# EAGLE design led quadcoopter (EAGLE 7.5.0)
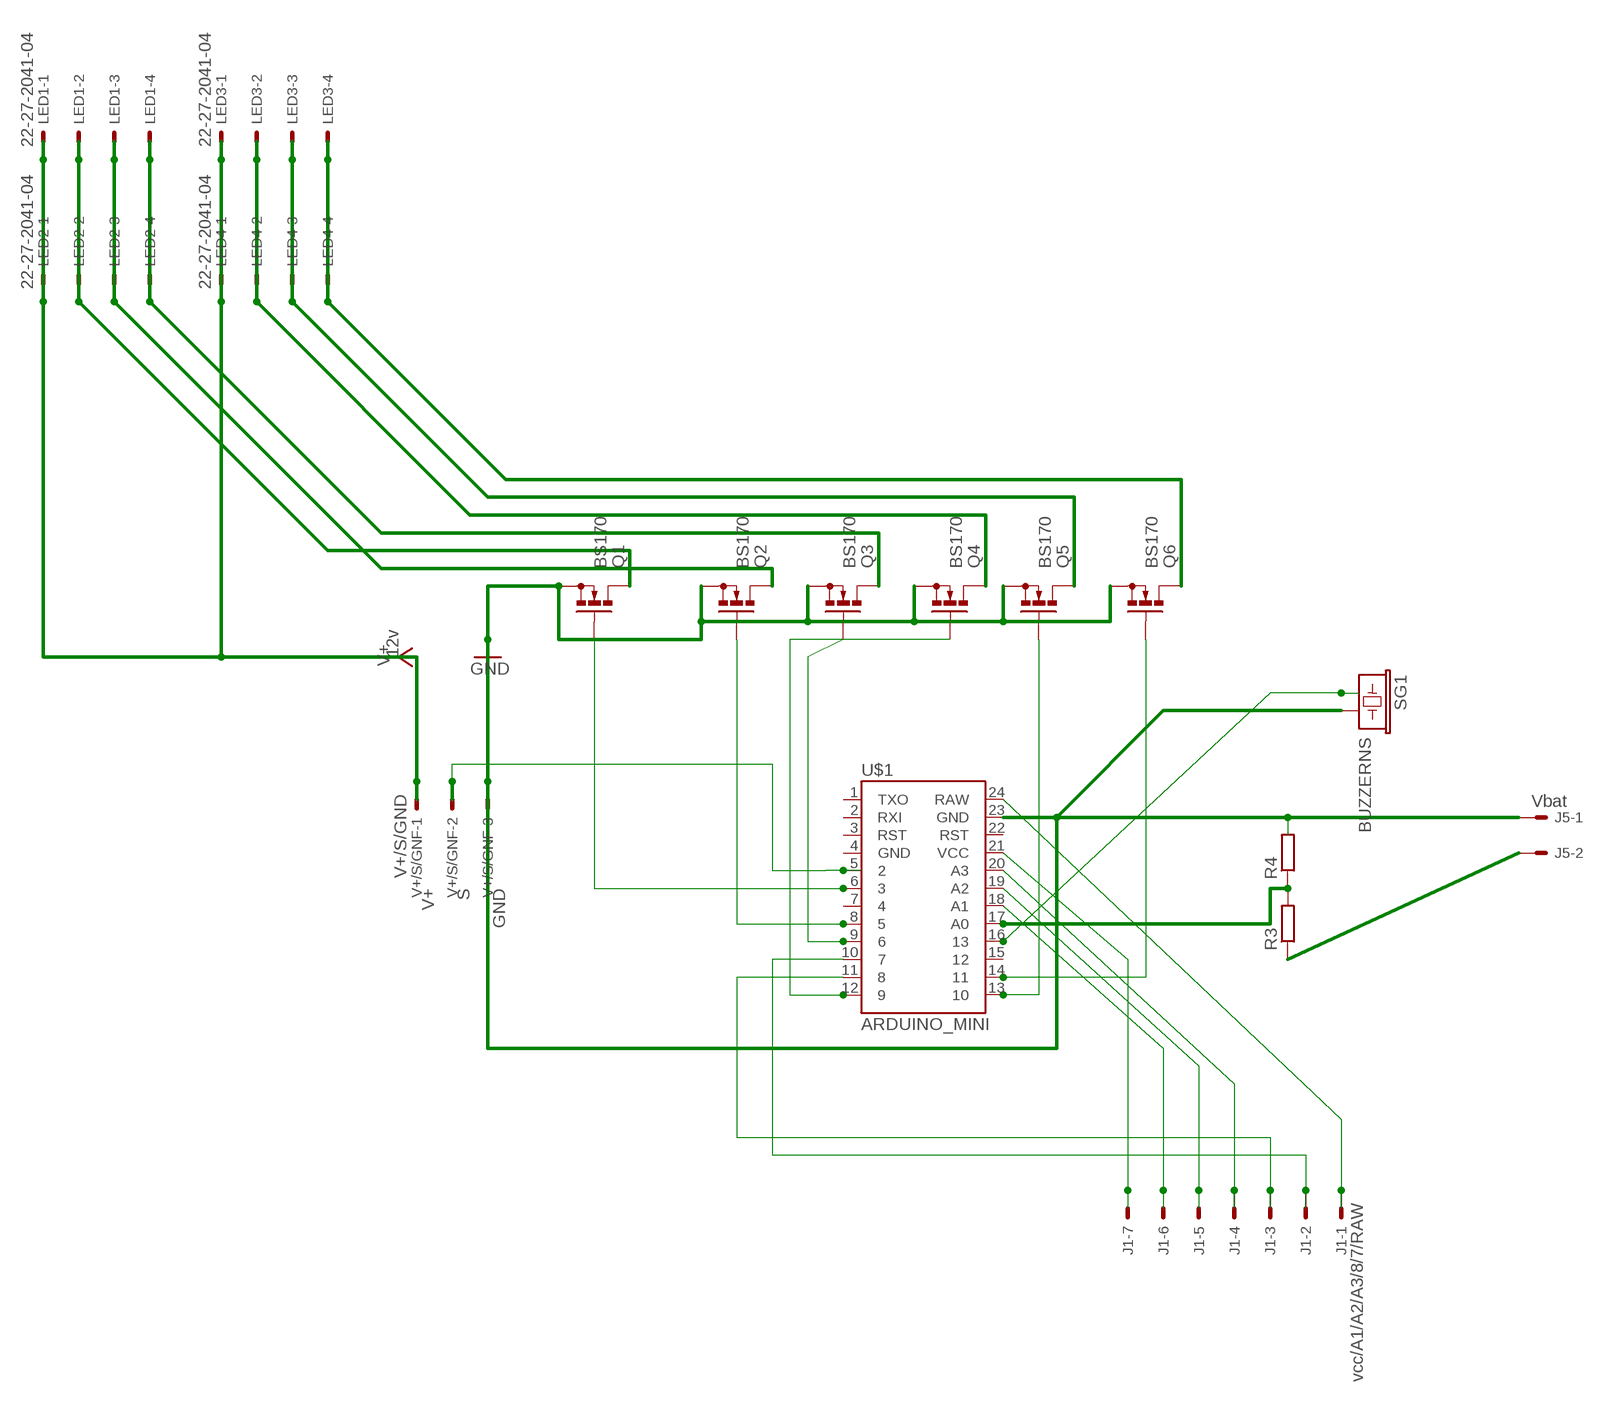
[diagram p0: schematic, sheet 1]

## Parts
J1  vcc/A1/A2/A3/8/7/RAW  22-27-2071-07  [6410-07]
J5  Vbat  22-27-2021-02  [6410-02]
LED1  22-27-2041-04  [6410-04]
LED2  22-27-2041-04  [6410-04]
LED3  22-27-2041-04  [6410-04]
LED4  22-27-2041-04  [6410-04]
Q1  BS170  [SOT54E]
Q2  BS170  [SOT54E]
Q3  BS170  [SOT54E]
Q4  BS170  [SOT54E]
Q5  BS170  [SOT54E]
Q6  BS170  [SOT54E]
R3  R-EU_0207/10  [0207/10]
R4  R-EU_0207/10  [0207/10]
SG1  BUZZERNS  [BUZZER-12MM-NS]
U$1  ARDUINO_MINI  [ARDUINO_MINI]
V+/S/GNF  V+/S/GND  22-27-2031-03  [6410-03]

## Nets
GND: J5.1 Q1.S Q2.S Q3.S Q4.S Q5.S Q6.S R4.2 SG1.- U$1.23(GND) V+/S/GNF.3
N$1: LED1.4 LED2.4 Q3.D
N$2: R3.2 R4.1 U$1.17(A0)
N$3: SG1.+ U$1.16
N$4: J1.1 U$1.24(RAW)
N$5: J1.7 U$1.21(VCC)
N$6: J1.6 U$1.18(A1)
N$7: J1.5 U$1.19(A2)
N$8: LED1.2 LED2.2 Q1.D
N$9: LED1.3 LED2.3 Q2.D
N$10: LED3.2 LED4.2 Q4.D
N$11: LED3.3 LED4.3 Q5.D
N$12: LED3.4 LED4.4 Q6.D
N$13: U$1.5 V+/S/GNF.2
N$14: J1.4 U$1.20(A3)
N$15: J1.3 U$1.11
N$16: Q1.G U$1.6
N$17: Q2.G U$1.8
N$18: Q3.G U$1.9
N$19: Q4.G U$1.12
N$20: Q5.G U$1.13
N$21: Q6.G U$1.14
N$22: J1.2 U$1.10
V+: LED1.1 LED2.1 LED3.1 LED4.1 V+/S/GNF.1
VBAT: J5.2 R3.1
Unconnected: U$1.1(TXO) U$1.2(RXI) U$1.3(RST) U$1.4(GND) U$1.7 U$1.15 U$1.22(RST)

## Library data of the parts
J1 = con-molex:22-?-07: CONNECTOR wire to board 2.54 mm (.1 inch) pitch header; OC_FARNELL: unknown; OC_NEWARK: unknown
J5 = con-molex:22-?-02: CONNECTOR wire to board 2.54 mm (.1 inch) pitch header; OC_FARNELL: unknown; OC_NEWARK: unknown
LED1-LED4 = con-molex:22-?-04: CONNECTOR wire to board 2.54 mm (.1 inch) pitch header; OC_FARNELL: unknown; OC_NEWARK: unknown
Q1-Q6 = transistor-small-signal:BS170: N-CHANNEL MOS FET
R3 R4 = rcl:R-EU_: RESISTOR, European symbol
SG1 = SparkFun-Electromechanical:BUZZER: Buzzer 12mm Spark Fun Electronics SKU : Comp-Buzzer
U$1 = SparkFun-Boards:ARDUINO_MINI: Arduino Pro Mini footprint
V+/S/GNF = con-molex:22-?-03: CONNECTOR wire to board 2.54 mm (.1 inch) pitch header; MF: V+; OC_FARNELL: GND; OC_NEWARK: S

## Board
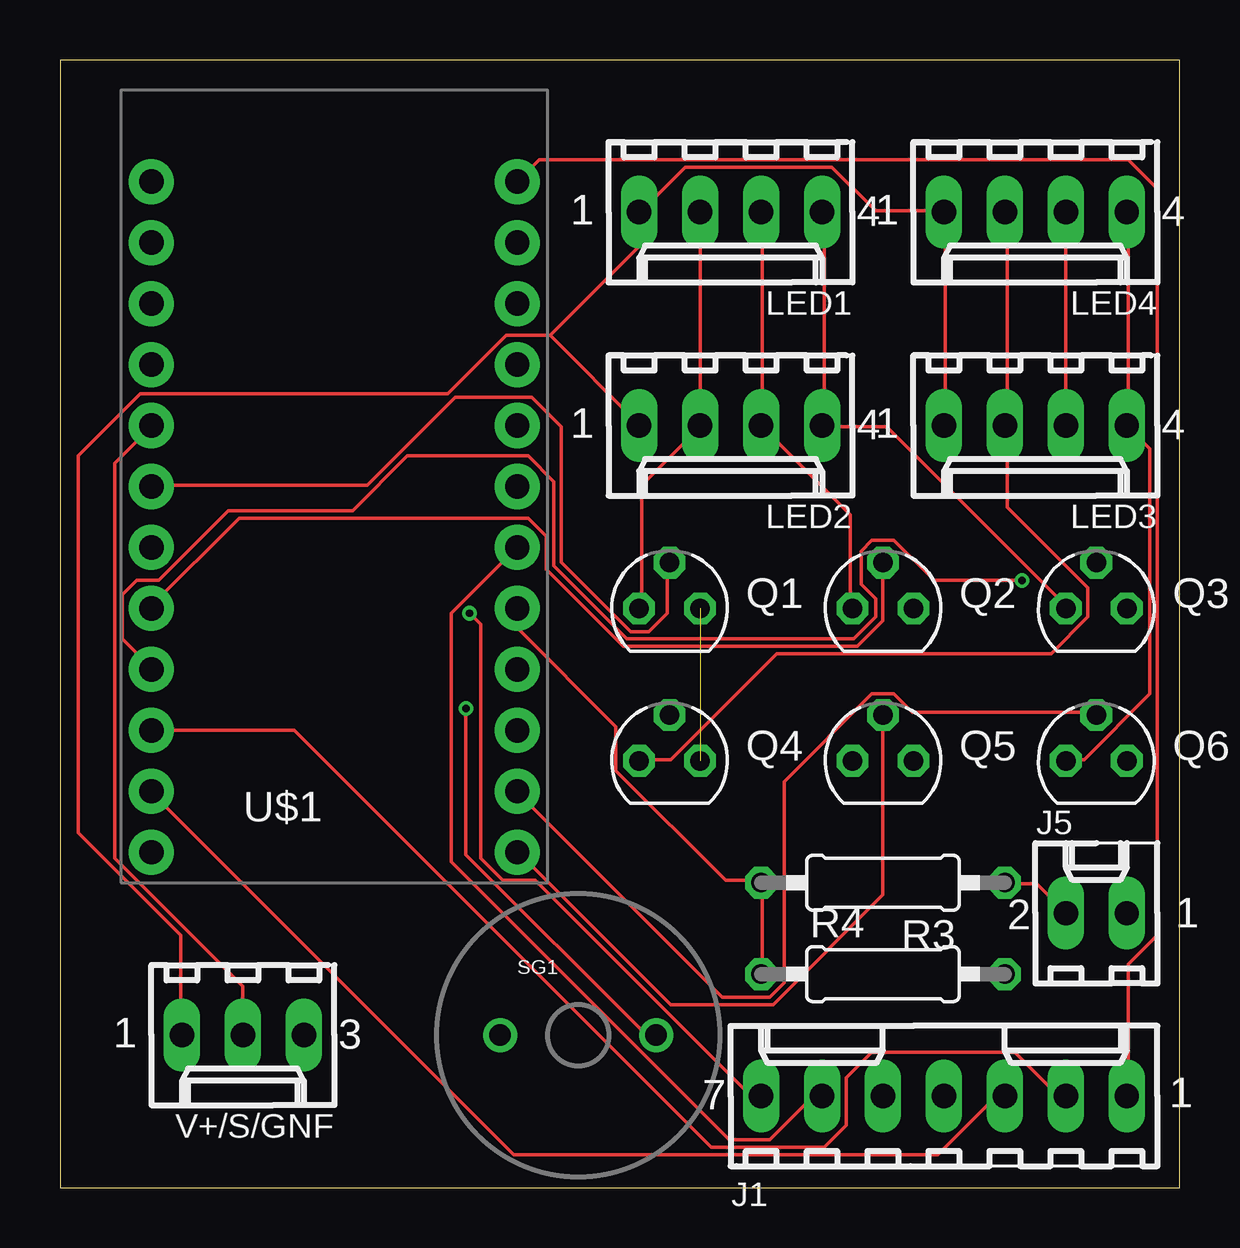
[diagram p1: board, top side]
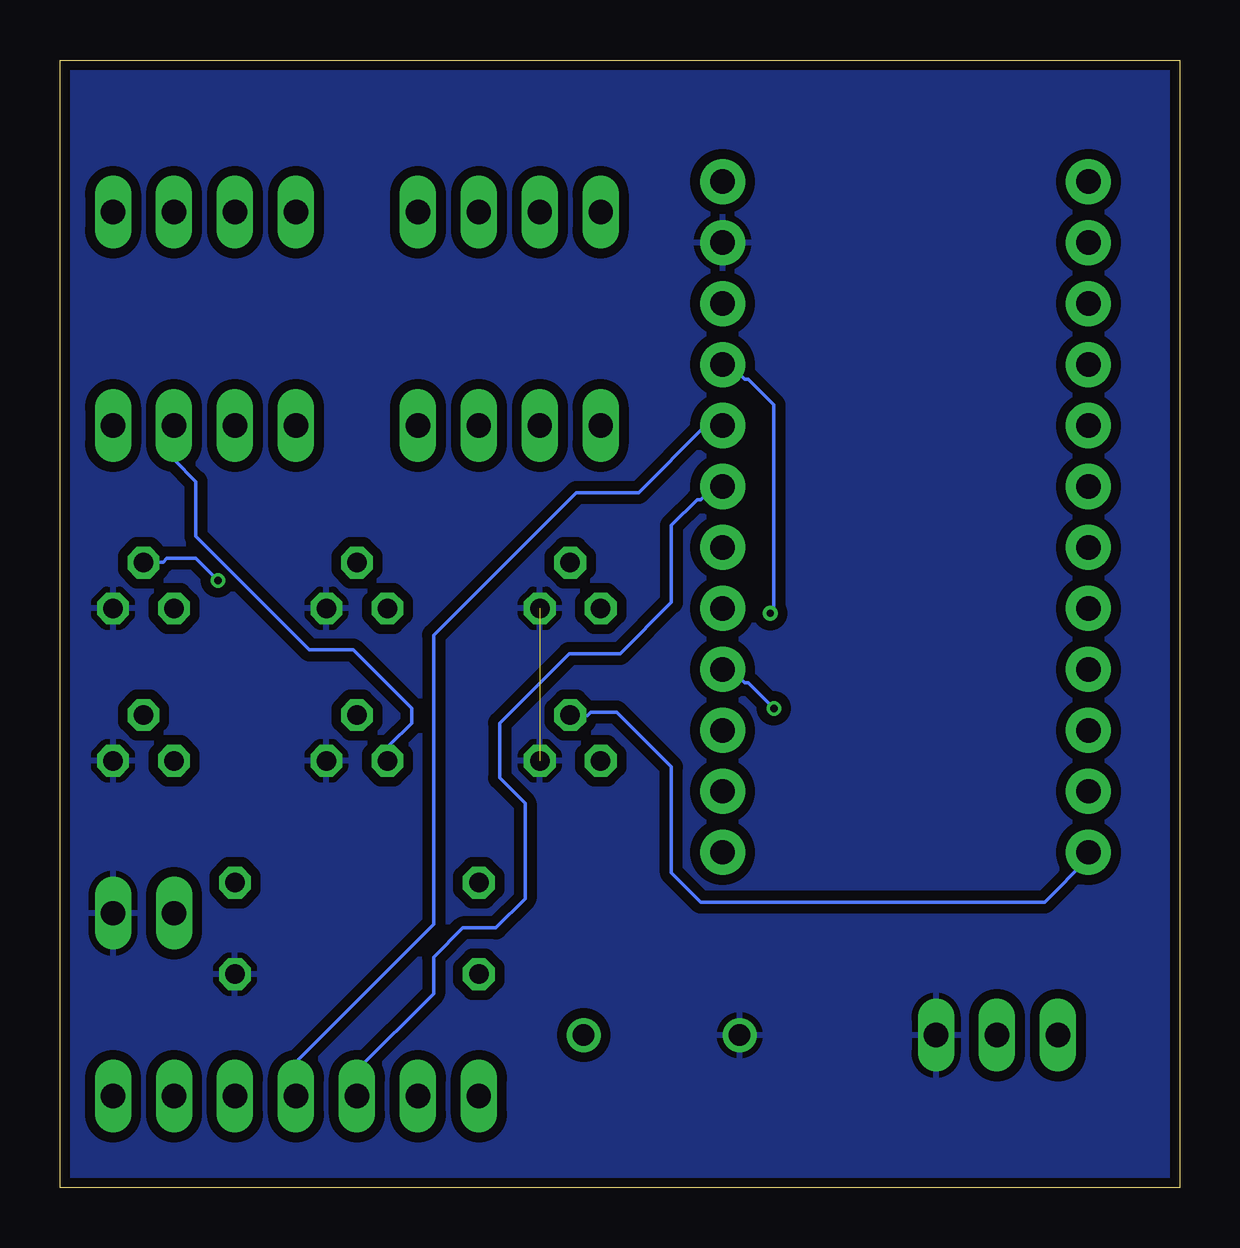
[diagram p2: board, bottom side, seen from below]

Size 46.66 x 46.98 mm. Coordinates in mm from the lower left corner, seen from the top.
Outline: 0,0 46.66,0 46.66,46.98 0,46.98 0,0
Copper layers (1*16): Top 0.035mm / dielectric 1.5mm / Bottom 0.035mm
Design rules "SeeedStudio_2layer_DRU_no_angle_20140221": minimum track width 6mil, minimum drill 12mil, track to track 6mil, track to pad 6mil, pad to pad 6mil, via to via 6mil, smd to smd 0mil, copper to edge 10mil, drill to drill 10mil, minimum pad ring 10mil, minimum via ring 6mil, stop-mask expansion 2mil, vias tented up to drill 100mil, thermal gap 10mil

### Footprints (pad centres in the part's own frame; a part is rotated, then mirrored left to right if it is on the bottom)
6410-07 = drill 1.016 long: 1 7.62,0; 2 5.08,0; 3 2.54,0; 4 0,0; 5 -2.54,0; 6 -5.08,0; 7 -7.62,0
6410-02 = drill 1.016 long: 1 1.27,0; 2 -1.27,0
6410-04 = drill 1.016 long: 1 3.81,0; 2 1.27,0; 3 -1.27,0; 4 -3.81,0
SOT54E = drill 0.813 octagon: D -1.27,0; G 0,1.905; S 1.27,0
0207/10 = drill 0.813 octagon: 1 -5.08,0; 2 5.08,0
BUZZER-12MM-NS = drill 0.9: + 3.25,0; - -3.25,0
ARDUINO_MINI = drill 1.016 pad 1.88: 1 -7.62,12.7; 2 -7.62,10.16; 3 -7.62,7.62; 4 -7.62,5.08; 5 -7.62,2.54; 6 -7.62,0; 7 -7.62,-2.54; 8 -7.62,-5.08; 9 -7.62,-7.62; 10 -7.62,-10.16; 11 -7.62,-12.7; 12 -7.62,-15.24; 13 7.62,-15.24; 14 7.62,-12.7; 15 7.62,-10.16; 16 7.62,-7.62; 17 7.62,-5.08; 18 7.62,-2.54; 19 7.62,0; 20 7.62,2.54; 21 7.62,5.08; 22 7.62,7.62; 23 7.62,10.16; 24 7.62,12.7
6410-03 = drill 1.016 long: 1 2.54,0; 2 0,0; 3 -2.54,0

### Placement (x,y rotation side)
J1  36.83,3.81 0 top
J5  43.18,11.43 0 top
LED1  27.94,40.64 180 top
LED2  27.94,31.75 180 top
LED3  40.64,31.75 180 top
LED4  40.64,40.64 180 top
Q1  25.4,24.13 0 top
Q2  34.29,24.13 0 top
Q3  43.18,24.13 0 top
Q4  25.4,17.78 0 top
Q5  34.29,17.78 0 top
Q6  43.18,17.78 0 top
R3  34.29,12.7 180 top
R4  34.29,8.89 0 top
SG1  21.59,6.35 0 top
U$1  11.43,29.21 0 top
V+/S/GNF  7.62,6.35 180 top

### Tracks (layer width: path | path; a pad name or v marks a point on that pad's centre or on a via)
GND  (1 unrouted)
  pour Bottom (isolate 0.406): 0,46.99 46.99,46.99 46.99,0 0,0
N$1
  Top 0.152: Q3.D 41.91,24.23 34.44,31.7 31.85,31.7 LED2.4 31.85,31.85 31.85,40.54 LED1.4
N$2
  Top 0.152: R4.1 29.26,8.99 29.26,12.65 R3.2 29.11,12.8 27.74,12.8 23.17,17.37 23.17,19.2 19.05,23.32 U$1.17
N$3  (via drill 0.3)
  Top 0.152: v16.92,19.96 16.92,13.87 24.38,6.4 24.69,6.4 SG1.+
  Bottom 0.152: v16.92,19.96 17.98,21.03 18.14,21.03 18.59,21.49 19.05,21.49 U$1.16
N$4
  Top 0.152: U$1.24 19.96,42.82 44.5,42.82 45.72,41.6 45.72,10.52 44.5,9.3 44.5,3.81 J1.1
N$5  (via drill 0.3)
  Top 0.152: J1.7 28.8,3.81 19.81,12.8 18.44,12.8 17.53,13.72 17.53,23.47 v17.07,23.93
  Bottom 0.152: v17.07,23.93 16.92,24.08 16.92,32.61 17.98,33.68 18.14,33.68 18.75,34.29 U$1.21
N$6
  Top 0.152: J1.6 31.39,3.81 29.57,1.98 27.89,1.98 16.31,13.56 16.31,23.93 U$1.18
N$7
  Bottom 0.152: J1.5 34.29,4.88 31.09,8.08 31.09,9.6 29.87,10.82 28.5,10.82 27.28,12.04 27.28,16 28.35,17.07 28.35,19.36 25.45,22.25 23.32,22.25 21.18,24.38 21.18,27.58 20.12,28.65 19.96,28.65 19.51,29.11 19.05,29.11 U$1.19
N$8
  Top 0.152: Q1.D 24.23,24.23 24.23,29.26 26.67,31.7 LED2.2 LED1.2
N$9
  Top 0.152: Q2.D 32.92,24.23 32.92,28.04 LED2.3 29.26,31.85 29.26,40.54 LED1.3
N$10
  Top 0.152: Q4.D 24.23,17.83 25.45,17.83 29.87,22.25 41.3,22.25 42.82,23.77 42.82,24.99 39.47,28.35 39.47,31.7 LED3.2 39.47,31.85 39.47,40.54 LED4.2
N$11
  Top 0.152: LED3.3 LED4.3
  Bottom 0.152: LED3.3 41.91,30.33 41,29.41 41,27.13 36.27,22.4 34.44,22.4 32,19.96 32,19.36 32.92,18.44 32.92,17.83 Q5.D
N$12
  Top 0.152: Q6.D 41.91,17.83 42.67,17.83 45.41,20.57 45.41,30.79 LED3.4 44.5,31.85 44.5,40.54 LED4.4
N$13
  Top 0.152: V+/S/GNF.2 7.62,8.38 2.29,13.72 2.29,30.18 3.81,31.7 U$1.5
N$14
  Bottom 0.152: J1.4 36.73,3.81 36.73,5.33 31.09,10.97 31.09,23.01 25.15,28.96 22.55,28.96 19.81,31.7 19.05,31.7 U$1.20
N$15
  Top 0.152: J1.3 39.01,3.81 36.58,1.37 18.9,1.37 3.81,16.46 U$1.11
N$16
  Top 0.152: Q1.G 25.3,25.91 25.3,23.93 24.54,23.17 23.77,23.17 20.88,26.06 20.88,31.7 19.66,32.92 16.46,32.92 12.8,29.26 3.81,29.26 U$1.6
N$17
  Top 0.152: Q2.G 34.29,23.62 33.22,22.55 23.47,22.55 20.27,25.76 20.27,27.13 19.51,27.89 7.47,27.89 3.81,24.23 U$1.8
N$18  (via drill 0.3)
  Top 0.152: v40.08,25.3 36.42,25.3 34.75,26.97 33.83,26.97 33.38,26.52 33.38,25.15 33.98,24.54 33.98,23.77 33.07,22.86 23.62,22.86 20.57,25.91 20.57,29.41 19.51,30.48 14.48,30.48 12.19,28.19 7.01,28.19 4.12,25.3 3.2,25.3 2.59,24.69 2.59,22.86 3.81,21.64 U$1.9
  Bottom 0.152: v40.08,25.3 41,26.21 42.21,26.21 42.37,26.06 43.13,26.06 Q3.G
N$19
  Bottom 0.152: U$1.12 3.81,13.72 5.64,11.89 19.96,11.89 21.18,13.11 21.18,17.53 23.47,19.81 24.54,19.81 24.69,19.66 25.3,19.66 Q4.G
N$20
  Top 0.152: Q5.G 34.29,12.19 29.72,7.62 25.45,7.62 19.05,14.02 U$1.13
N$21
  Top 0.152: Q6.G 43.13,19.81 35.51,19.81 34.75,20.57 33.83,20.57 30.18,16.92 30.18,8.53 29.57,7.93 27.58,7.93 19.05,16.46 U$1.14
N$22
  Top 0.152: J1.2 41.6,3.81 39.78,5.64 33.83,5.64 32.77,4.57 32.77,2.59 31.85,1.68 27.13,1.68 9.75,19.05 U$1.10
V+
  Top 0.152: LED3.1 36.88,31.85 36.88,40.54 LED4.1 36.73,40.69 33.98,40.69 32.16,42.52 26.06,42.52 24.23,40.69 LED1.1 24.08,40.54 24.08,39.17 20.42,35.51 | 20.42,35.51 18.59,35.51 16.15,33.07 3.35,33.07 0.76,30.48 0.76,14.78 5.03,10.52 5.03,6.4 V+/S/GNF.1 | 20.42,35.51 24.08,31.85 LED2.1
VBAT
  Top 0.152: J5.2 40.69,12.65 39.47,12.65 R3.1